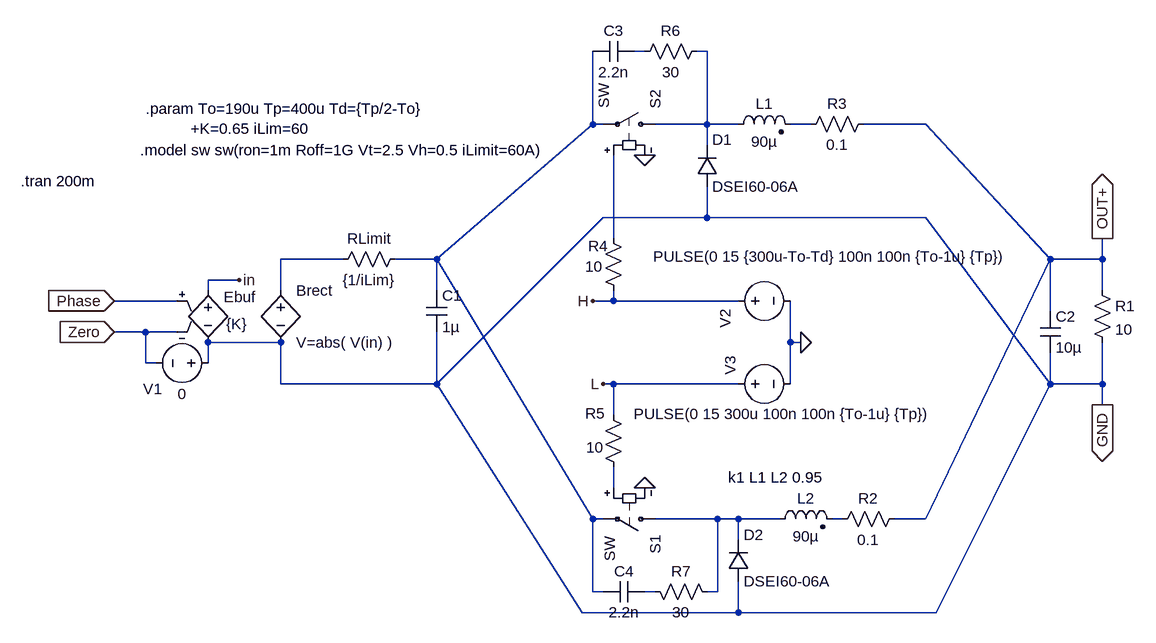
[diagram p0: schematic Chopper2.asc]
Chopper2.asc, the LTspice schematic file:
Version 4
SHEET 1 1732 852
WIRE 464 -448 448 -448
WIRE 560 -448 544 -448
WIRE 384 -336 384 -448
WIRE 400 -336 384 -336
WIRE 560 -336 560 -448
WIRE 560 -336 480 -336
WIRE 608 -336 560 -336
WIRE 720 -336 688 -336
WIRE 896 -336 800 -336
WIRE 560 -304 560 -336
WIRE 560 -192 560 -240
WIRE 560 -192 400 -192
WIRE 896 -192 560 -192
WIRE 416 -160 416 -288
WIRE 0 -128 -96 -128
WIRE 144 -128 384 -336
WIRE 144 -128 80 -128
WIRE 1088 -128 896 -336
WIRE 1168 -128 1168 -160
WIRE 1168 -128 1088 -128
WIRE -160 -96 -208 -96
WIRE -208 -80 -208 -96
WIRE -96 -80 -96 -128
WIRE 144 -80 144 -128
WIRE 1168 -80 1168 -128
WIRE -256 -64 -352 -64
WIRE 416 -64 416 -80
WIRE 416 -64 384 -64
WIRE 608 -64 416 -64
WIRE 1088 -48 1088 -128
WIRE -304 -16 -352 -16
WIRE -256 -16 -304 -16
WIRE -96 0 -208 0
WIRE 688 0 688 -64
WIRE 704 0 688 0
WIRE -304 32 -304 -16
WIRE -288 32 -304 32
WIRE -208 32 -208 0
WIRE -96 64 -96 0
WIRE 144 64 400 -192
WIRE 144 64 144 -16
WIRE 144 64 -96 64
WIRE 416 64 400 64
WIRE 608 64 416 64
WIRE 688 64 688 0
WIRE 1088 64 896 -192
WIRE 1088 64 1088 16
WIRE 1168 64 1168 0
WIRE 1168 64 1088 64
WIRE 1168 96 1168 64
WIRE 416 112 416 64
WIRE 416 224 416 192
WIRE 384 272 144 -128
WIRE 400 272 384 272
WIRE 576 272 480 272
WIRE 608 272 576 272
WIRE 672 272 608 272
WIRE 768 272 752 272
WIRE 896 272 1088 -128
WIRE 896 272 848 272
WIRE 608 304 608 272
WIRE 384 384 384 272
WIRE 400 384 384 384
WIRE 480 384 464 384
WIRE 576 384 576 272
WIRE 576 384 560 384
WIRE 368 416 144 64
WIRE 608 416 608 368
WIRE 608 416 368 416
WIRE 912 416 1088 64
WIRE 912 416 608 416
FLAG 1168 -160 OUT+
IOPIN 1168 -160 Out
FLAG 384 -64 H
FLAG 400 64 L
FLAG 704 0 0
FLAG 464 224 0
FLAG 464 -288 0
FLAG -352 -64 Phase
IOPIN -352 -64 In
FLAG 1168 96 GND
IOPIN 1168 96 Out
FLAG -352 -16 Zero
IOPIN -352 -16 In
FLAG -160 -96 in
SYMBOL cap 128 -80 R0
SYMATTR InstName C1
SYMATTR Value 1µ
SYMBOL ind2 592 -320 R270
WINDOW 0 32 56 VTop 0
WINDOW 3 5 56 VBottom 0
SYMATTR InstName L1
SYMATTR Value 90µ
SYMATTR Type ind
SYMBOL ind2 656 288 R270
WINDOW 0 32 56 VTop 0
WINDOW 3 5 56 VBottom 0
SYMATTR InstName L2
SYMATTR Value 90µ
SYMATTR Type ind
SYMBOL cap 1072 -48 R0
SYMATTR InstName C2
SYMATTR Value 10µ
SYMBOL res 1152 -96 R0
SYMATTR InstName R1
SYMATTR Value 10
SYMBOL voltage 592 -64 R270
WINDOW 3 68 -115 VRight 0
WINDOW 123 0 0 Left 0
WINDOW 39 0 0 Left 0
WINDOW 0 -42 -4 Left 0
SYMATTR Value PULSE(0 15 {300u-To-Td} 100n 100n {To-1u} {Tp})
SYMATTR InstName V2
SYMBOL voltage 592 64 R270
WINDOW 3 -46 -145 VRight 0
WINDOW 123 0 0 Left 0
WINDOW 39 0 0 Left 0
WINDOW 0 14 4 Left 0
SYMATTR Value PULSE(0 15 300u 100n 100n {To-1u} {Tp})
SYMATTR InstName V3
SYMBOL res 864 256 R90
WINDOW 0 0 56 VBottom 0
WINDOW 3 32 56 VTop 0
SYMATTR InstName R2
SYMATTR Value 0.1
SYMBOL res 816 -352 R90
WINDOW 0 0 56 VBottom 0
WINDOW 3 32 56 VTop 0
SYMATTR InstName R3
SYMATTR Value 0.1
SYMBOL res 400 -176 R0
WINDOW 0 -23 28 Left 0
WINDOW 3 -28 59 Left 0
SYMATTR InstName R4
SYMATTR Value 10
SYMBOL res 400 96 R0
WINDOW 0 -28 13 Left 0
WINDOW 3 -26 66 Left 0
SYMATTR InstName R5
SYMATTR Value 10
SYMBOL sw 496 272 R90
WINDOW 3 27 86 Left 0
SYMATTR InstName S1
SYMBOL sw 496 -336 M270
WINDOW 3 24 95 Left 0
SYMATTR InstName S2
SYMBOL cap 448 -464 R90
WINDOW 0 0 32 VBottom 0
WINDOW 3 32 32 VTop 0
SYMATTR InstName C3
SYMATTR Value 2.2n
SYMBOL res 560 -464 R90
WINDOW 0 0 56 VBottom 0
WINDOW 3 32 56 VTop 0
SYMATTR InstName R6
SYMATTR Value 30
SYMBOL cap 464 400 M270
WINDOW 0 32 32 VTop 0
WINDOW 3 0 32 VBottom 0
SYMATTR InstName C4
SYMATTR Value 2.2n
SYMBOL res 576 400 M270
WINDOW 0 32 56 VTop 0
WINDOW 3 0 56 VBottom 0
SYMATTR InstName R7
SYMATTR Value 30
SYMBOL diode 544 -240 M180
WINDOW 0 24 72 Left 0
WINDOW 3 24 0 Left 0
SYMATTR InstName D1
SYMATTR Value DSEI60-06A
SYMBOL diode 592 368 M180
WINDOW 0 24 72 Left 0
WINDOW 3 24 0 Left 0
SYMATTR InstName D2
SYMATTR Value DSEI60-06A
SYMBOL e -208 -96 R0
WINDOW 0 24 26 Left 0
WINDOW 3 28 68 Left 0
SYMATTR InstName Ebuf
SYMATTR Value {K}
SYMBOL bv -96 -96 R0
SYMATTR InstName Brect
SYMATTR Value V=abs( V(in) )
SYMBOL res 96 -144 R90
WINDOW 0 0 56 VBottom 0
WINDOW 3 32 56 VTop 0
SYMATTR InstName RLimit
SYMATTR Value {1/iLim}
SYMBOL voltage -192 32 R90
WINDOW 0 55 101 VBottom 0
WINDOW 3 32 56 VTop 0
SYMATTR InstName V1
SYMATTR Value 0
TEXT -304 -360 Left 0 !.param To=190u Tp=400u Td={Tp/2-To}\n          +K=0.65 iLim=60
TEXT -496 -248 Left 0 !.tran 200m
TEXT -312 -296 Left 0 !.model sw sw(ron=1m Roff=1G Vt=2.5 Vh=0.5 iLimit=60A)
TEXT 592 208 Left 0 !k1 L1 L2 0.95

The netlist it stands for:
* Chopper2.asc
C1 N003 GND 1µ
L1 N002 N004 90µ
L2 N008 N009 90µ
C2 OUT+ GND 10µ
R1 OUT+ GND 10
V2 H 0 PULSE(0 15 {300u-To-Td} 100n 100n {To-1u} {Tp})
V3 L 0 PULSE(0 15 300u 100n 100n {To-1u} {Tp})
R2 OUT+ N009 0.1
R3 OUT+ N004 0.1
R4 N005 H 10
R5 L N007 10
S1 N008 N003 N007 0 SW
S2 N002 N003 N005 0 SW
C3 N001 N003 2.2n
R6 N002 N001 30
C4 N010 N003 2.2n
R7 N008 N010 30
D1 GND N002 DSEI60-06A
D2 GND N008 DSEI60-06A
Ebuf in GND Phase Zero {K}
Brect N006 GND V=abs( V(in) )
RLimit N003 N006 {1/iLim}
V1 GND Zero 0
.model D D
.lib standard.dio
.param To=190u Tp=400u Td={Tp/2-To}
          +K=0.65 iLim=60
.tran 200m
.model sw sw(ron=1m Roff=1G Vt=2.5 Vh=0.5 iLimit=60A)
k1 L1 L2 0.95
.backanno
.end